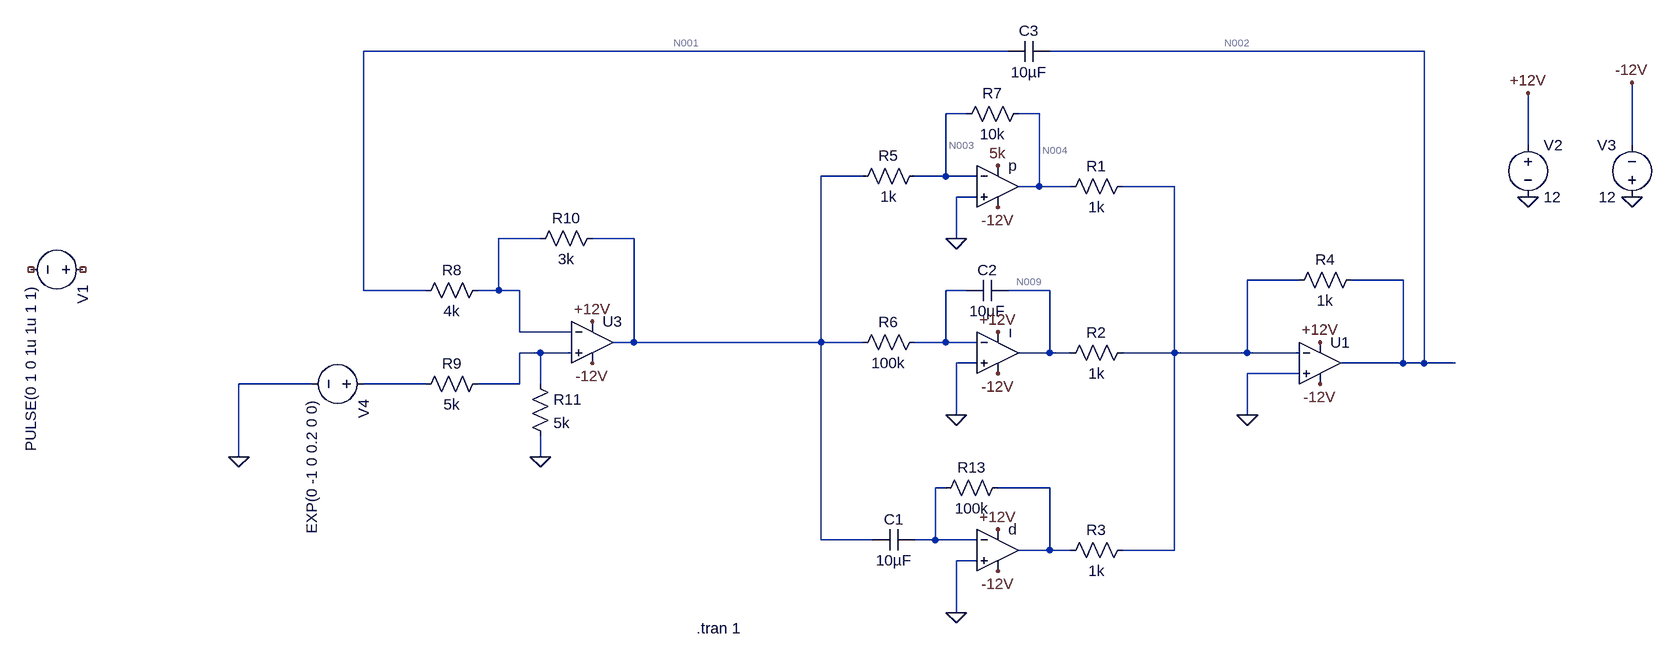
[diagram p0: schematic Draft3.asc]
Draft3.asc, the LTspice schematic file:
Version 4
SHEET 1 1324 680
WIRE -48 -848 -1040 -848
WIRE 592 -848 16 -848
WIRE -112 -752 -144 -752
WIRE 0 -752 -32 -752
WIRE 752 -704 752 -784
WIRE 912 -704 912 -800
WIRE -272 -656 -336 -656
WIRE -144 -656 -144 -752
WIRE -144 -656 -192 -656
WIRE -96 -656 -144 -656
WIRE 0 -640 0 -752
WIRE 0 -640 -32 -640
WIRE 48 -640 0 -640
WIRE 208 -640 128 -640
WIRE -96 -624 -128 -624
WIRE -768 -560 -832 -560
WIRE -624 -560 -688 -560
WIRE -128 -560 -128 -624
WIRE 400 -496 320 -496
WIRE 560 -496 480 -496
WIRE -1040 -480 -1040 -848
WIRE -944 -480 -1040 -480
WIRE -832 -480 -832 -560
WIRE -832 -480 -864 -480
WIRE -800 -480 -832 -480
WIRE -112 -480 -144 -480
WIRE 16 -480 -48 -480
WIRE -800 -416 -800 -480
WIRE -720 -416 -800 -416
WIRE -624 -400 -624 -560
WIRE -624 -400 -656 -400
WIRE -336 -400 -336 -656
WIRE -336 -400 -624 -400
WIRE -272 -400 -336 -400
WIRE -144 -400 -144 -480
WIRE -144 -400 -192 -400
WIRE -96 -400 -144 -400
WIRE -768 -384 -800 -384
WIRE -720 -384 -768 -384
WIRE 16 -384 16 -480
WIRE 16 -384 -32 -384
WIRE 48 -384 16 -384
WIRE 208 -384 208 -640
WIRE 208 -384 128 -384
WIRE 320 -384 320 -496
WIRE 320 -384 208 -384
WIRE 400 -384 320 -384
WIRE -96 -368 -128 -368
WIRE 560 -368 560 -496
WIRE 560 -368 464 -368
WIRE 592 -368 592 -848
WIRE 592 -368 560 -368
WIRE 640 -368 592 -368
WIRE 400 -352 320 -352
WIRE -1120 -336 -1232 -336
WIRE -944 -336 -1040 -336
WIRE -800 -336 -800 -384
WIRE -800 -336 -864 -336
WIRE -768 -336 -768 -384
WIRE -128 -288 -128 -368
WIRE 320 -288 320 -352
WIRE -1232 -224 -1232 -336
WIRE -768 -224 -768 -256
WIRE -144 -176 -160 -176
WIRE 16 -176 -64 -176
WIRE -336 -96 -336 -400
WIRE -256 -96 -336 -96
WIRE -160 -96 -160 -176
WIRE -160 -96 -192 -96
WIRE -96 -96 -160 -96
WIRE 16 -80 16 -176
WIRE 16 -80 -32 -80
WIRE 48 -80 16 -80
WIRE 208 -80 208 -384
WIRE 208 -80 128 -80
WIRE -96 -64 -128 -64
WIRE -128 16 -128 -64
FLAG -128 -560 0
FLAG -128 -288 0
FLAG -128 16 0
FLAG -1232 -224 0
FLAG 320 -288 0
FLAG -64 -672 5k
FLAG -64 -608 -12V
FLAG -64 -416 +12V
FLAG -64 -352 -12V
FLAG -64 -112 +12V
FLAG -64 -48 -12V
FLAG 432 -400 +12V
FLAG 432 -336 -12V
FLAG 752 -624 0
FLAG 752 -784 +12V
FLAG 912 -624 0
FLAG 912 -800 -12V
FLAG -768 -224 0
FLAG -688 -432 +12V
FLAG -688 -368 -12V
SYMBOL OpAmps\\UniversalOpAmp2 -64 -80 R0
SYMATTR InstName d
SYMBOL OpAmps\\UniversalOpAmp2 -64 -384 R0
SYMATTR InstName ı
SYMBOL OpAmps\\UniversalOpAmp2 -64 -640 R0
SYMATTR InstName p
SYMBOL res 144 -656 R90
WINDOW 0 0 56 VBottom 2
WINDOW 3 32 56 VTop 2
SYMATTR InstName R1
SYMATTR Value 1k
SYMATTR SpiceLine tol=1 pwr=0.1
SYMBOL res 144 -400 R90
WINDOW 0 0 56 VBottom 2
WINDOW 3 32 56 VTop 2
SYMATTR InstName R2
SYMATTR Value 1k
SYMBOL res 144 -96 R90
WINDOW 0 0 56 VBottom 2
WINDOW 3 32 56 VTop 2
SYMATTR InstName R3
SYMATTR Value 1k
SYMBOL OpAmps\\UniversalOpAmp2 432 -368 R0
SYMATTR InstName U1
SYMBOL res 496 -512 R90
WINDOW 0 0 56 VBottom 2
WINDOW 3 32 56 VTop 2
SYMATTR InstName R4
SYMATTR Value 1k
SYMBOL res -176 -672 R90
WINDOW 0 0 56 VBottom 2
WINDOW 3 32 56 VTop 2
SYMATTR InstName R5
SYMATTR Value 1k
SYMBOL res -176 -416 R90
WINDOW 0 0 56 VBottom 2
WINDOW 3 32 56 VTop 2
SYMATTR InstName R6
SYMATTR Value 100k
SYMBOL cap -192 -112 R90
WINDOW 0 0 32 VBottom 2
WINDOW 3 32 32 VTop 2
SYMATTR InstName C1
SYMATTR Value 10µF
SYMBOL res -16 -768 R90
WINDOW 0 0 56 VBottom 2
WINDOW 3 32 56 VTop 2
SYMATTR InstName R7
SYMATTR Value 10k
SYMBOL cap -48 -496 R90
WINDOW 0 0 32 VBottom 2
WINDOW 3 32 32 VTop 2
SYMATTR InstName C2
SYMATTR Value 10µF
SYMBOL res -48 -192 R90
WINDOW 0 0 56 VBottom 2
WINDOW 3 32 56 VTop 2
SYMATTR InstName R13
SYMATTR Value 100k
SYMBOL voltage -1456 -512 R90
WINDOW 123 0 0 Left 0
WINDOW 39 0 0 Left 0
SYMATTR InstName V1
SYMATTR Value PULSE(0 1 0 1u 1u 1 1)
SYMBOL cap 16 -864 R90
WINDOW 0 0 32 VBottom 2
WINDOW 3 32 32 VTop 2
SYMATTR InstName C3
SYMATTR Value 10µF
SYMBOL voltage 752 -720 R0
WINDOW 123 0 0 Left 0
WINDOW 39 0 0 Left 0
SYMATTR InstName V2
SYMATTR Value 12
SYMBOL voltage 912 -608 R180
WINDOW 0 24 96 Left 2
WINDOW 3 24 16 Left 2
WINDOW 123 0 0 Left 0
WINDOW 39 0 0 Left 0
SYMATTR InstName V3
SYMATTR Value 12
SYMBOL res -848 -496 R90
WINDOW 0 0 56 VBottom 2
WINDOW 3 32 56 VTop 2
SYMATTR InstName R8
SYMATTR Value 4k
SYMBOL res -848 -352 R90
WINDOW 0 0 56 VBottom 2
WINDOW 3 32 56 VTop 2
SYMATTR InstName R9
SYMATTR Value 5k
SYMBOL res -672 -576 R90
WINDOW 0 0 56 VBottom 2
WINDOW 3 32 56 VTop 2
SYMATTR InstName R10
SYMATTR Value 3k
SYMBOL OpAmps\\UniversalOpAmp2 -688 -400 R0
SYMATTR InstName U3
SYMBOL res -784 -352 R0
SYMATTR InstName R11
SYMATTR Value 5k
SYMBOL voltage -1024 -336 R90
WINDOW 123 0 0 Left 0
WINDOW 39 0 0 Left 0
SYMATTR InstName V4
SYMATTR Value EXP(0 -1 0 0.2 0 0)
TEXT -528 40 Left 2 !.tran 1

The netlist it stands for:
* Draft3.asc
Xd 0 N012 +12V -12V N013 level2 Avol=1Meg GBW=10Meg Slew=10Meg Ilimit=25m Rail=0 Vos=0 En=0 Enk=0 In=0 Ink=0 Rin=500Meg  ; pins In+ In- V+ V- OUT
Xı 0 N008 +12V -12V N009 level2 Avol=1Meg GBW=10Meg Slew=10Meg Ilimit=25m Rail=0 Vos=0 En=0 Enk=0 In=0 Ink=0 Rin=500Meg  ; pins In+ In- V+ V- OUT
Xp 0 N003 5k -12V N004 level2 Avol=1Meg GBW=10Meg Slew=10Meg Ilimit=25m Rail=0 Vos=0 En=0 Enk=0 In=0 Ink=0 Rin=500Meg  ; pins In+ In- V+ V- OUT
R1 N006 N004 1k tol=1 pwr=0.1
R2 N006 N009 1k
R3 N006 N013 1k
XU1 0 N006 +12V -12V N002 level2 Avol=1Meg GBW=10Meg Slew=10Meg Ilimit=25m Rail=0 Vos=0 En=0 Enk=0 In=0 Ink=0 Rin=500Meg  ; pins In+ In- V+ V- OUT
R4 N002 N006 1k
R5 N003 N005 1k
R6 N008 N005 100k
C1 N012 N005 10µF
R7 N004 N003 10k
C2 N009 N008 10µF
R13 N013 N012 100k
V1 NC_01 NC_02 PULSE(0 1 0 1u 1u 1 1)
C3 N002 N001 10µF
V2 +12V 0 12
V3 0 -12V 12
R8 N007 N001 4k
R9 N010 N011 5k
R10 N005 N007 3k
XU3 N010 N007 +12V -12V N005 level2 Avol=1Meg GBW=10Meg Slew=10Meg Ilimit=25m Rail=0 Vos=0 En=0 Enk=0 In=0 Ink=0 Rin=500Meg  ; pins In+ In- V+ V- OUT
R11 N010 0 5k
V4 N011 0 EXP(0 -1 0 0.2 0 0)
.tran 1
.lib UniversalOpAmp2.lib
.backanno
.end

* Results of the author's LTspice run, read from the files saved beside the schematic
* Operating Point, zero values left out:
*   V(+12v) = 12 V
*   V(-12v) = -12 V
*   V(n009) = 2.367 µV
*   V(n004) = -2.653 mV
*   V(5k) = -2.653 mV
*   V(n003) = -252.1 µV
*   V(n002) = 2.651 mV
*   I(R1) = 2.653 µA
*   I(R2) = -2.37 nA
*   I(R3) = -2.681 pA
*   I(R4) = 2.651 µA
*   I(R5) = -252.1 nA
*   I(R7) = -240.1 nA
*   I(V2) = -4.798 mA
*   I(V3) = -4.798 mA
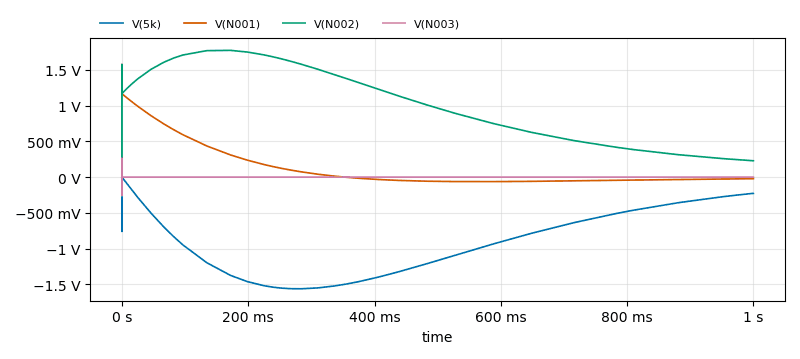
[diagram p1: Transient Analysis of Draft3.asc, plotted from the saved traces]
* Transient Analysis, 1 run:
*   V(5k): min -1.563 V, max 139.5 mV, average -918.3 mV, rms 1.026 V, last -227.1 mV
*   V(N001): min -63.08 mV, max 1.575 V, average 109.7 mV, rms 308.5 mV, last -22.44 mV
*   V(N002): min 2.651 mV, max 1.774 V, average 995.1 mV, rms 1.132 V, last 228.8 mV
*   V(N003): min -262.3 mV, max 263.7 mV, average -6.039 µV, rms 199.3 µV, last 87.36 µV